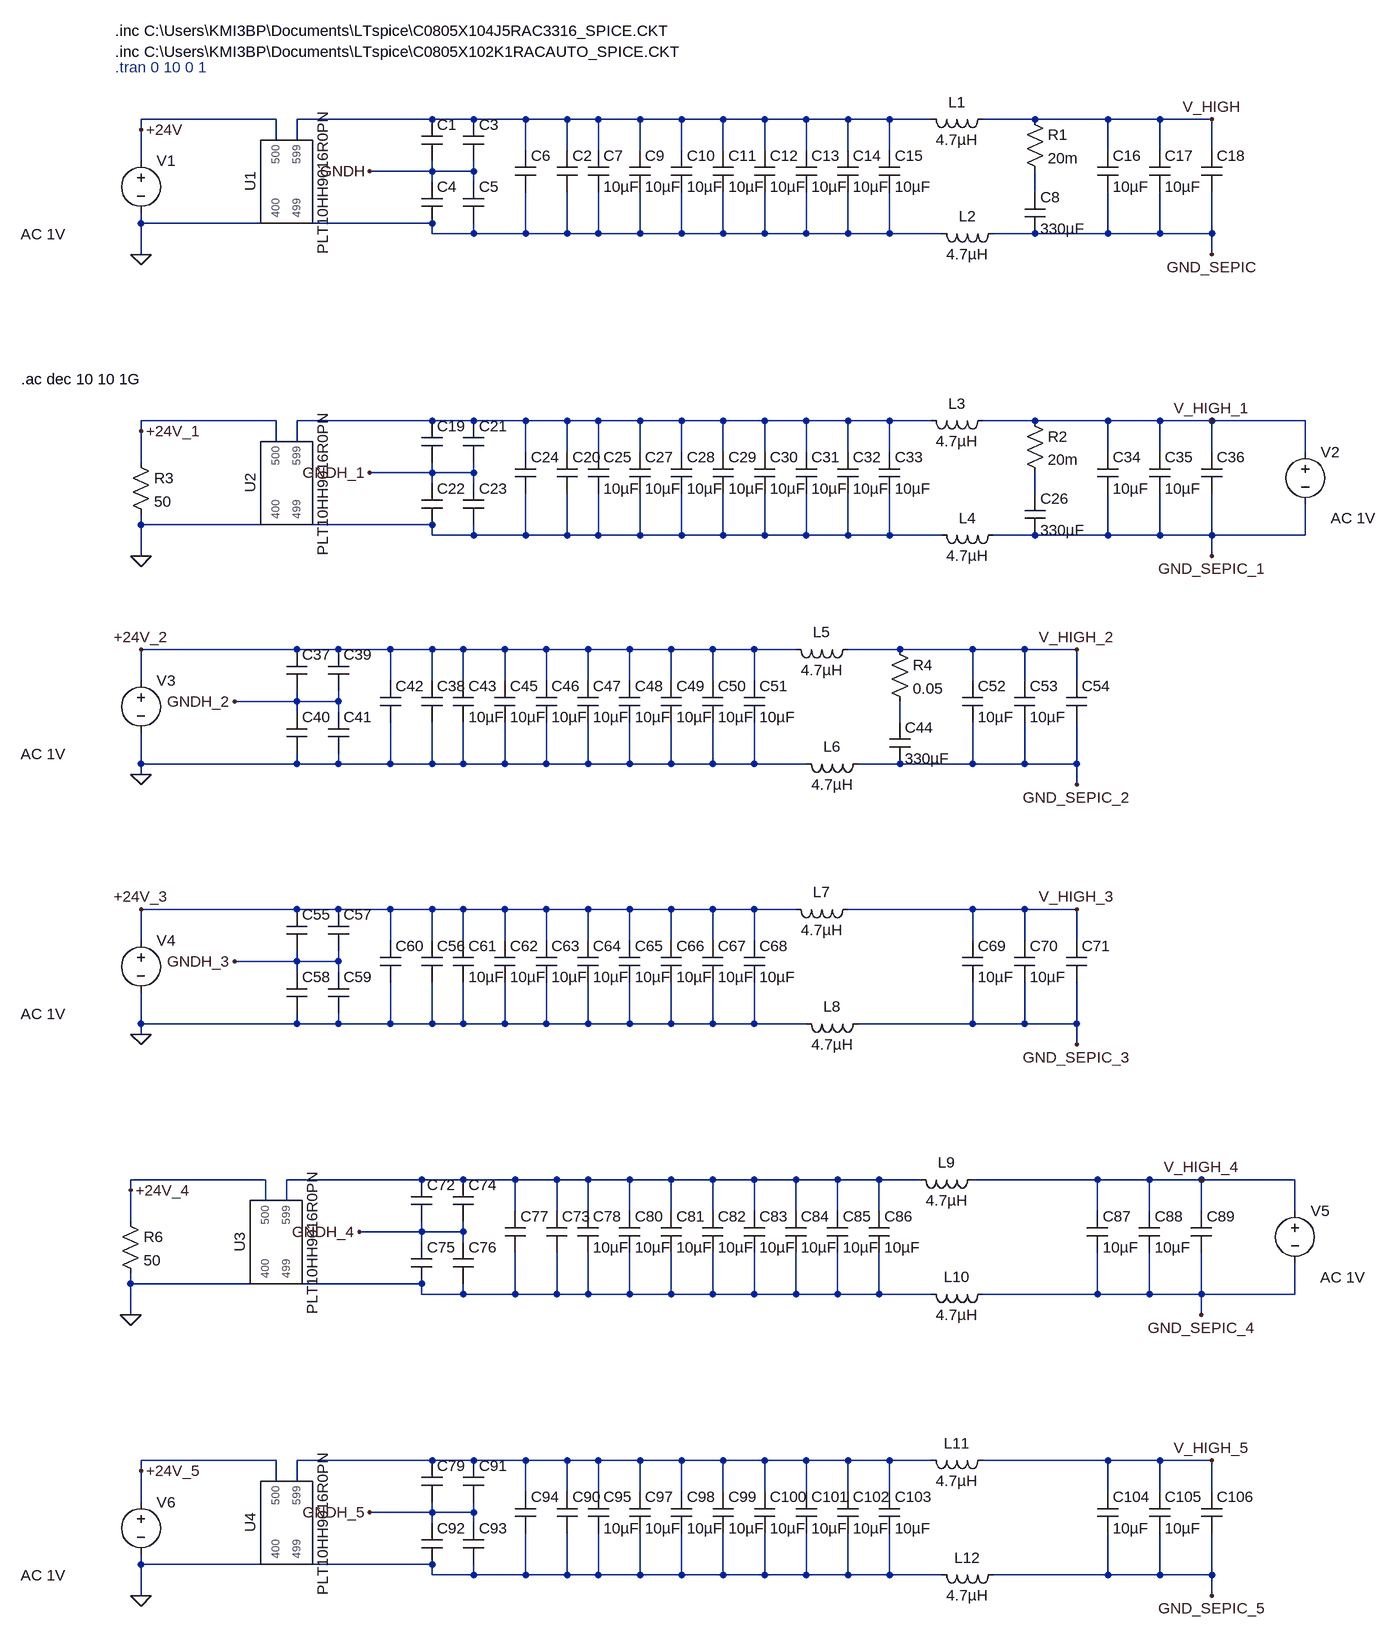
[diagram p0: schematic Draft2.asc]
Draft2.asc, the LTspice schematic file:
Version 4
SHEET 1 1840 3012
WIRE 144 80 -64 80
WIRE 384 80 176 80
WIRE 448 80 384 80
WIRE 528 80 448 80
WIRE 592 80 528 80
WIRE 640 80 592 80
WIRE 704 80 640 80
WIRE 768 80 704 80
WIRE 832 80 768 80
WIRE 896 80 832 80
WIRE 960 80 896 80
WIRE 1024 80 960 80
WIRE 1088 80 1024 80
WIRE 1152 80 1088 80
WIRE 1312 80 1232 80
WIRE 1424 80 1312 80
WIRE 1504 80 1424 80
WIRE 1584 80 1504 80
WIRE -64 96 -64 80
WIRE 144 112 144 80
WIRE 176 112 176 80
WIRE 528 128 528 80
WIRE 592 128 592 80
WIRE 640 128 640 80
WIRE 704 128 704 80
WIRE 768 128 768 80
WIRE 832 128 832 80
WIRE 896 128 896 80
WIRE 960 128 960 80
WIRE 1024 128 1024 80
WIRE 1088 128 1088 80
WIRE 1424 128 1424 80
WIRE 1504 128 1504 80
WIRE 1584 128 1584 80
WIRE -64 144 -64 96
WIRE 384 160 384 144
WIRE 384 160 288 160
WIRE 448 160 448 144
WIRE 448 160 384 160
WIRE 384 176 384 160
WIRE 448 176 448 160
WIRE 1312 192 1312 160
WIRE -64 240 -64 224
WIRE 144 240 -64 240
WIRE 384 240 176 240
WIRE 384 256 384 240
WIRE 448 256 448 240
WIRE 448 256 384 256
WIRE 528 256 528 192
WIRE 528 256 448 256
WIRE 592 256 592 192
WIRE 592 256 528 256
WIRE 640 256 640 192
WIRE 640 256 592 256
WIRE 704 256 704 192
WIRE 704 256 640 256
WIRE 768 256 768 192
WIRE 768 256 704 256
WIRE 832 256 832 192
WIRE 832 256 768 256
WIRE 896 256 896 192
WIRE 896 256 832 256
WIRE 960 256 960 192
WIRE 960 256 896 256
WIRE 1024 256 1024 192
WIRE 1024 256 960 256
WIRE 1088 256 1088 192
WIRE 1088 256 1024 256
WIRE 1168 256 1088 256
WIRE 1312 256 1248 256
WIRE 1424 256 1424 192
WIRE 1424 256 1312 256
WIRE 1504 256 1504 192
WIRE 1504 256 1424 256
WIRE 1584 256 1584 192
WIRE 1584 256 1504 256
WIRE -64 288 -64 240
WIRE 1584 288 1584 256
WIRE 144 544 -64 544
WIRE 384 544 176 544
WIRE 448 544 384 544
WIRE 528 544 448 544
WIRE 592 544 528 544
WIRE 640 544 592 544
WIRE 704 544 640 544
WIRE 768 544 704 544
WIRE 832 544 768 544
WIRE 896 544 832 544
WIRE 960 544 896 544
WIRE 1024 544 960 544
WIRE 1088 544 1024 544
WIRE 1152 544 1088 544
WIRE 1312 544 1232 544
WIRE 1424 544 1312 544
WIRE 1504 544 1424 544
WIRE 1584 544 1504 544
WIRE 1728 544 1584 544
WIRE -64 560 -64 544
WIRE 144 576 144 544
WIRE 176 576 176 544
WIRE 528 592 528 544
WIRE 592 592 592 544
WIRE 640 592 640 544
WIRE 704 592 704 544
WIRE 768 592 768 544
WIRE 832 592 832 544
WIRE 896 592 896 544
WIRE 960 592 960 544
WIRE 1024 592 1024 544
WIRE 1088 592 1088 544
WIRE 1424 592 1424 544
WIRE 1504 592 1504 544
WIRE 1584 592 1584 544
WIRE 1728 592 1728 544
WIRE -64 608 -64 560
WIRE 384 624 384 608
WIRE 384 624 288 624
WIRE 448 624 448 608
WIRE 448 624 384 624
WIRE 384 640 384 624
WIRE 448 640 448 624
WIRE 1312 656 1312 624
WIRE -64 704 -64 688
WIRE 144 704 -64 704
WIRE 384 704 176 704
WIRE 384 720 384 704
WIRE 448 720 448 704
WIRE 448 720 384 720
WIRE 528 720 528 656
WIRE 528 720 448 720
WIRE 592 720 592 656
WIRE 592 720 528 720
WIRE 640 720 640 656
WIRE 640 720 592 720
WIRE 704 720 704 656
WIRE 704 720 640 720
WIRE 768 720 768 656
WIRE 768 720 704 720
WIRE 832 720 832 656
WIRE 832 720 768 720
WIRE 896 720 896 656
WIRE 896 720 832 720
WIRE 960 720 960 656
WIRE 960 720 896 720
WIRE 1024 720 1024 656
WIRE 1024 720 960 720
WIRE 1088 720 1088 656
WIRE 1088 720 1024 720
WIRE 1168 720 1088 720
WIRE 1312 720 1248 720
WIRE 1424 720 1424 656
WIRE 1424 720 1312 720
WIRE 1504 720 1504 656
WIRE 1504 720 1424 720
WIRE 1584 720 1584 656
WIRE 1584 720 1504 720
WIRE 1728 720 1728 672
WIRE 1728 720 1584 720
WIRE -64 752 -64 704
WIRE 1584 752 1584 720
WIRE 176 896 -64 896
WIRE 240 896 176 896
WIRE 320 896 240 896
WIRE 384 896 320 896
WIRE 432 896 384 896
WIRE 496 896 432 896
WIRE 560 896 496 896
WIRE 624 896 560 896
WIRE 688 896 624 896
WIRE 752 896 688 896
WIRE 816 896 752 896
WIRE 880 896 816 896
WIRE 944 896 880 896
WIRE 1104 896 1024 896
WIRE 1216 896 1104 896
WIRE 1296 896 1216 896
WIRE 1376 896 1296 896
WIRE -64 944 -64 896
WIRE 320 944 320 896
WIRE 384 944 384 896
WIRE 432 944 432 896
WIRE 496 944 496 896
WIRE 560 944 560 896
WIRE 624 944 624 896
WIRE 688 944 688 896
WIRE 752 944 752 896
WIRE 816 944 816 896
WIRE 880 944 880 896
WIRE 1216 944 1216 896
WIRE 1296 944 1296 896
WIRE 1376 944 1376 896
WIRE 176 976 176 960
WIRE 176 976 80 976
WIRE 240 976 240 960
WIRE 240 976 176 976
WIRE 176 992 176 976
WIRE 240 992 240 976
WIRE 1104 1008 1104 976
WIRE -64 1072 -64 1024
WIRE 176 1072 176 1056
WIRE 176 1072 -64 1072
WIRE 240 1072 240 1056
WIRE 240 1072 176 1072
WIRE 320 1072 320 1008
WIRE 320 1072 240 1072
WIRE 384 1072 384 1008
WIRE 384 1072 320 1072
WIRE 432 1072 432 1008
WIRE 432 1072 384 1072
WIRE 496 1072 496 1008
WIRE 496 1072 432 1072
WIRE 560 1072 560 1008
WIRE 560 1072 496 1072
WIRE 624 1072 624 1008
WIRE 624 1072 560 1072
WIRE 688 1072 688 1008
WIRE 688 1072 624 1072
WIRE 752 1072 752 1008
WIRE 752 1072 688 1072
WIRE 816 1072 816 1008
WIRE 816 1072 752 1072
WIRE 880 1072 880 1008
WIRE 880 1072 816 1072
WIRE 960 1072 880 1072
WIRE 1104 1072 1040 1072
WIRE 1216 1072 1216 1008
WIRE 1216 1072 1104 1072
WIRE 1296 1072 1296 1008
WIRE 1296 1072 1216 1072
WIRE 1376 1072 1376 1008
WIRE 1376 1072 1296 1072
WIRE -64 1088 -64 1072
WIRE 1376 1104 1376 1072
WIRE 176 1296 -64 1296
WIRE 240 1296 176 1296
WIRE 320 1296 240 1296
WIRE 384 1296 320 1296
WIRE 432 1296 384 1296
WIRE 496 1296 432 1296
WIRE 560 1296 496 1296
WIRE 624 1296 560 1296
WIRE 688 1296 624 1296
WIRE 752 1296 688 1296
WIRE 816 1296 752 1296
WIRE 880 1296 816 1296
WIRE 944 1296 880 1296
WIRE 1216 1296 1024 1296
WIRE 1296 1296 1216 1296
WIRE 1376 1296 1296 1296
WIRE -64 1344 -64 1296
WIRE 320 1344 320 1296
WIRE 384 1344 384 1296
WIRE 432 1344 432 1296
WIRE 496 1344 496 1296
WIRE 560 1344 560 1296
WIRE 624 1344 624 1296
WIRE 688 1344 688 1296
WIRE 752 1344 752 1296
WIRE 816 1344 816 1296
WIRE 880 1344 880 1296
WIRE 1216 1344 1216 1296
WIRE 1296 1344 1296 1296
WIRE 1376 1344 1376 1296
WIRE 176 1376 176 1360
WIRE 176 1376 80 1376
WIRE 240 1376 240 1360
WIRE 240 1376 176 1376
WIRE 176 1392 176 1376
WIRE 240 1392 240 1376
WIRE -64 1472 -64 1424
WIRE 176 1472 176 1456
WIRE 176 1472 -64 1472
WIRE 240 1472 240 1456
WIRE 240 1472 176 1472
WIRE 320 1472 320 1408
WIRE 320 1472 240 1472
WIRE 384 1472 384 1408
WIRE 384 1472 320 1472
WIRE 432 1472 432 1408
WIRE 432 1472 384 1472
WIRE 496 1472 496 1408
WIRE 496 1472 432 1472
WIRE 560 1472 560 1408
WIRE 560 1472 496 1472
WIRE 624 1472 624 1408
WIRE 624 1472 560 1472
WIRE 688 1472 688 1408
WIRE 688 1472 624 1472
WIRE 752 1472 752 1408
WIRE 752 1472 688 1472
WIRE 816 1472 816 1408
WIRE 816 1472 752 1472
WIRE 880 1472 880 1408
WIRE 880 1472 816 1472
WIRE 960 1472 880 1472
WIRE 1216 1472 1216 1408
WIRE 1216 1472 1040 1472
WIRE 1296 1472 1296 1408
WIRE 1296 1472 1216 1472
WIRE 1376 1472 1376 1408
WIRE 1376 1472 1296 1472
WIRE -64 1488 -64 1472
WIRE 1376 1504 1376 1472
WIRE 128 1712 -80 1712
WIRE 368 1712 160 1712
WIRE 432 1712 368 1712
WIRE 512 1712 432 1712
WIRE 576 1712 512 1712
WIRE 624 1712 576 1712
WIRE 688 1712 624 1712
WIRE 752 1712 688 1712
WIRE 816 1712 752 1712
WIRE 880 1712 816 1712
WIRE 944 1712 880 1712
WIRE 1008 1712 944 1712
WIRE 1072 1712 1008 1712
WIRE 1136 1712 1072 1712
WIRE 1408 1712 1216 1712
WIRE 1488 1712 1408 1712
WIRE 1568 1712 1488 1712
WIRE 1712 1712 1568 1712
WIRE -80 1728 -80 1712
WIRE 128 1744 128 1712
WIRE 160 1744 160 1712
WIRE 512 1760 512 1712
WIRE 576 1760 576 1712
WIRE 624 1760 624 1712
WIRE 688 1760 688 1712
WIRE 752 1760 752 1712
WIRE 816 1760 816 1712
WIRE 880 1760 880 1712
WIRE 944 1760 944 1712
WIRE 1008 1760 1008 1712
WIRE 1072 1760 1072 1712
WIRE 1408 1760 1408 1712
WIRE 1488 1760 1488 1712
WIRE 1568 1760 1568 1712
WIRE 1712 1760 1712 1712
WIRE -80 1776 -80 1728
WIRE 368 1792 368 1776
WIRE 368 1792 272 1792
WIRE 432 1792 432 1776
WIRE 432 1792 368 1792
WIRE 368 1808 368 1792
WIRE 432 1808 432 1792
WIRE -80 1872 -80 1856
WIRE 128 1872 -80 1872
WIRE 368 1872 160 1872
WIRE 368 1888 368 1872
WIRE 432 1888 432 1872
WIRE 432 1888 368 1888
WIRE 512 1888 512 1824
WIRE 512 1888 432 1888
WIRE 576 1888 576 1824
WIRE 576 1888 512 1888
WIRE 624 1888 624 1824
WIRE 624 1888 576 1888
WIRE 688 1888 688 1824
WIRE 688 1888 624 1888
WIRE 752 1888 752 1824
WIRE 752 1888 688 1888
WIRE 816 1888 816 1824
WIRE 816 1888 752 1888
WIRE 880 1888 880 1824
WIRE 880 1888 816 1888
WIRE 944 1888 944 1824
WIRE 944 1888 880 1888
WIRE 1008 1888 1008 1824
WIRE 1008 1888 944 1888
WIRE 1072 1888 1072 1824
WIRE 1072 1888 1008 1888
WIRE 1152 1888 1072 1888
WIRE 1408 1888 1408 1824
WIRE 1408 1888 1232 1888
WIRE 1488 1888 1488 1824
WIRE 1488 1888 1408 1888
WIRE 1568 1888 1568 1824
WIRE 1568 1888 1488 1888
WIRE 1712 1888 1712 1840
WIRE 1712 1888 1568 1888
WIRE -80 1920 -80 1872
WIRE 1568 1920 1568 1888
WIRE 144 2144 -64 2144
WIRE 384 2144 176 2144
WIRE 448 2144 384 2144
WIRE 528 2144 448 2144
WIRE 592 2144 528 2144
WIRE 640 2144 592 2144
WIRE 704 2144 640 2144
WIRE 768 2144 704 2144
WIRE 832 2144 768 2144
WIRE 896 2144 832 2144
WIRE 960 2144 896 2144
WIRE 1024 2144 960 2144
WIRE 1088 2144 1024 2144
WIRE 1152 2144 1088 2144
WIRE 1424 2144 1232 2144
WIRE 1504 2144 1424 2144
WIRE 1584 2144 1504 2144
WIRE -64 2160 -64 2144
WIRE 144 2176 144 2144
WIRE 176 2176 176 2144
WIRE 528 2192 528 2144
WIRE 592 2192 592 2144
WIRE 640 2192 640 2144
WIRE 704 2192 704 2144
WIRE 768 2192 768 2144
WIRE 832 2192 832 2144
WIRE 896 2192 896 2144
WIRE 960 2192 960 2144
WIRE 1024 2192 1024 2144
WIRE 1088 2192 1088 2144
WIRE 1424 2192 1424 2144
WIRE 1504 2192 1504 2144
WIRE 1584 2192 1584 2144
WIRE -64 2208 -64 2160
WIRE 384 2224 384 2208
WIRE 384 2224 288 2224
WIRE 448 2224 448 2208
WIRE 448 2224 384 2224
WIRE 384 2240 384 2224
WIRE 448 2240 448 2224
WIRE -64 2304 -64 2288
WIRE 144 2304 -64 2304
WIRE 384 2304 176 2304
WIRE 384 2320 384 2304
WIRE 448 2320 448 2304
WIRE 448 2320 384 2320
WIRE 528 2320 528 2256
WIRE 528 2320 448 2320
WIRE 592 2320 592 2256
WIRE 592 2320 528 2320
WIRE 640 2320 640 2256
WIRE 640 2320 592 2320
WIRE 704 2320 704 2256
WIRE 704 2320 640 2320
WIRE 768 2320 768 2256
WIRE 768 2320 704 2320
WIRE 832 2320 832 2256
WIRE 832 2320 768 2320
WIRE 896 2320 896 2256
WIRE 896 2320 832 2320
WIRE 960 2320 960 2256
WIRE 960 2320 896 2320
WIRE 1024 2320 1024 2256
WIRE 1024 2320 960 2320
WIRE 1088 2320 1088 2256
WIRE 1088 2320 1024 2320
WIRE 1168 2320 1088 2320
WIRE 1424 2320 1424 2256
WIRE 1424 2320 1248 2320
WIRE 1504 2320 1504 2256
WIRE 1504 2320 1424 2320
WIRE 1584 2320 1584 2256
WIRE 1584 2320 1504 2320
WIRE -64 2352 -64 2304
WIRE 1584 2352 1584 2320
FLAG -64 288 0
FLAG -64 96 +24V
FLAG 288 160 GNDH
FLAG 1584 288 GND_SEPIC
FLAG 1584 80 V_HIGH
FLAG -64 752 0
FLAG -64 560 +24V_1
FLAG 288 624 GNDH_1
FLAG 1584 752 GND_SEPIC_1
FLAG 1584 544 V_HIGH_1
FLAG 80 976 GNDH_2
FLAG -64 1088 0
FLAG 1376 1104 GND_SEPIC_2
FLAG 1376 896 V_HIGH_2
FLAG -64 896 +24V_2
FLAG 80 1376 GNDH_3
FLAG -64 1488 0
FLAG 1376 1504 GND_SEPIC_3
FLAG 1376 1296 V_HIGH_3
FLAG -64 1296 +24V_3
FLAG -80 1920 0
FLAG -80 1728 +24V_4
FLAG 272 1792 GNDH_4
FLAG 1568 1920 GND_SEPIC_4
FLAG 1568 1712 V_HIGH_4
FLAG -64 2352 0
FLAG -64 2160 +24V_5
FLAG 288 2224 GNDH_5
FLAG 1584 2352 GND_SEPIC_5
FLAG 1584 2144 V_HIGH_5
SYMBOL PLT10HH9016R0PN 160 176 R270
SYMATTR InstName U1
SYMBOL voltage -64 128 R0
WINDOW 3 -185 101 Left 2
WINDOW 123 -185 129 Left 2
WINDOW 39 0 0 Left 0
SYMATTR InstName V1
SYMATTR Value ""
SYMATTR Value2 AC 1V
SYMBOL cap 368 80 R0
WINDOW 3 24 56 Invisible 2
SYMATTR InstName C1
SYMATTR Value C0805X102K1RACAUTO
SYMATTR Prefix X
SYMBOL cap 576 128 R0
WINDOW 3 24 56 Invisible 2
SYMATTR InstName C2
SYMATTR Value C0805X104J5RAC3316
SYMATTR Prefix X
SYMBOL cap 432 80 R0
WINDOW 3 24 56 Invisible 2
SYMATTR InstName C3
SYMATTR Value C0805X102K1RACAUTO
SYMATTR Prefix X
SYMBOL cap 368 176 R0
WINDOW 3 24 56 Invisible 2
SYMATTR InstName C4
SYMATTR Value C0805X102K1RACAUTO
SYMATTR Prefix X
SYMBOL cap 432 176 R0
WINDOW 3 24 56 Invisible 2
SYMATTR InstName C5
SYMATTR Value C0805X102K1RACAUTO
SYMATTR Prefix X
SYMBOL cap 512 128 R0
WINDOW 3 24 56 Invisible 2
SYMATTR InstName C6
SYMATTR Value C0805X102K1RACAUTO
SYMATTR Prefix X
SYMBOL cap 624 128 R0
SYMATTR InstName C7
SYMATTR Value 10µF
SYMATTR SpiceLine V=50 Rser=2.2m Lser=0.6n Rpar=0.05G
SYMBOL ind 1248 64 R90
WINDOW 0 5 56 VBottom 2
WINDOW 3 32 56 VTop 2
SYMATTR InstName L1
SYMATTR Value 4.7µH
SYMATTR SpiceLine Rser=0.023 Rpar=6.2 Cpar=2.12pF
SYMBOL res 1296 64 R0
SYMATTR InstName R1
SYMATTR Value 20m
SYMATTR SpiceLine tol=1 pwr=125m
SYMBOL cap 1296 192 R0
SYMATTR InstName C8
SYMATTR Value 330µF
SYMATTR SpiceLine V=50 Irms=600m Rser=230m
SYMBOL cap 688 128 R0
SYMATTR InstName C9
SYMATTR Value 10µF
SYMATTR SpiceLine V=50 Rser=2.2m Lser=0.6n Rpar=0.05G
SYMBOL cap 752 128 R0
SYMATTR InstName C10
SYMATTR Value 10µF
SYMATTR SpiceLine V=50 Rser=2.2m Lser=0.6n Rpar=0.05G
SYMBOL cap 816 128 R0
SYMATTR InstName C11
SYMATTR Value 10µF
SYMATTR SpiceLine V=50 Rser=2.2m Lser=0.6n Rpar=0.05G
SYMBOL cap 880 128 R0
SYMATTR InstName C12
SYMATTR Value 10µF
SYMATTR SpiceLine V=50 Rser=2.2m Lser=0.6n Rpar=0.05G
SYMBOL cap 944 128 R0
SYMATTR InstName C13
SYMATTR Value 10µF
SYMATTR SpiceLine V=50 Rser=2.2m Lser=0.6n Rpar=0.05G
SYMBOL cap 1008 128 R0
SYMATTR InstName C14
SYMATTR Value 10µF
SYMATTR SpiceLine V=50 Rser=2.2m Lser=0.6n Rpar=0.05G
SYMBOL cap 1072 128 R0
SYMATTR InstName C15
SYMATTR Value 10µF
SYMATTR SpiceLine V=50 Rser=2.2m Lser=0.6n Rpar=0.05G
SYMBOL ind 1264 240 R90
WINDOW 0 5 56 VBottom 2
WINDOW 3 32 56 VTop 2
SYMATTR InstName L2
SYMATTR Value 4.7µH
SYMATTR SpiceLine Rser=0.023 Rpar=6.2 Cpar=2.12pF
SYMBOL cap 1408 128 R0
SYMATTR InstName C16
SYMATTR Value 10µF
SYMATTR SpiceLine V=50 Rser=2.2m Lser=0.6n Rpar=0.05G
SYMBOL cap 1488 128 R0
SYMATTR InstName C17
SYMATTR Value 10µF
SYMATTR SpiceLine V=50 Rser=2.2m Lser=0.6n Rpar=0.05G
SYMBOL cap 1568 128 R0
WINDOW 3 24 56 Invisible 2
SYMATTR InstName C18
SYMATTR Value C0805X104J5RAC3316
SYMATTR Prefix X
SYMBOL PLT10HH9016R0PN 160 640 R270
SYMATTR InstName U2
SYMBOL voltage 1728 576 R0
WINDOW 3 -185 101 Left 2
WINDOW 123 39 118 Left 2
WINDOW 39 0 0 Left 0
SYMATTR InstName V2
SYMATTR Value ""
SYMATTR Value2 AC 1V
SYMBOL cap 368 544 R0
WINDOW 3 24 56 Invisible 2
SYMATTR InstName C19
SYMATTR Value C0805X102K1RACAUTO
SYMATTR Prefix X
SYMBOL cap 576 592 R0
WINDOW 3 24 56 Invisible 2
SYMATTR InstName C20
SYMATTR Value C0805X104J5RAC3316
SYMATTR Prefix X
SYMBOL cap 432 544 R0
WINDOW 3 24 56 Invisible 2
SYMATTR InstName C21
SYMATTR Value C0805X102K1RACAUTO
SYMATTR Prefix X
SYMBOL cap 368 640 R0
WINDOW 3 24 56 Invisible 2
SYMATTR InstName C22
SYMATTR Value C0805X102K1RACAUTO
SYMATTR Prefix X
SYMBOL cap 432 640 R0
WINDOW 3 24 56 Invisible 2
SYMATTR InstName C23
SYMATTR Value C0805X102K1RACAUTO
SYMATTR Prefix X
SYMBOL cap 512 592 R0
WINDOW 3 24 56 Invisible 2
SYMATTR InstName C24
SYMATTR Value C0805X102K1RACAUTO
SYMATTR Prefix X
SYMBOL cap 624 592 R0
SYMATTR InstName C25
SYMATTR Value 10µF
SYMATTR SpiceLine V=50 Rser=2.2m Lser=0.6n Rpar=0.05G
SYMBOL ind 1248 528 R90
WINDOW 0 5 56 VBottom 2
WINDOW 3 32 56 VTop 2
SYMATTR InstName L3
SYMATTR Value 4.7µH
SYMATTR SpiceLine Rser=0.023 Rpar=6.2 Cpar=2.12pF
SYMBOL res 1296 528 R0
SYMATTR InstName R2
SYMATTR Value 20m
SYMATTR SpiceLine tol=1 pwr=125m
SYMBOL cap 1296 656 R0
SYMATTR InstName C26
SYMATTR Value 330µF
SYMATTR SpiceLine V=50 Irms=600m Rser=230m
SYMBOL cap 688 592 R0
SYMATTR InstName C27
SYMATTR Value 10µF
SYMATTR SpiceLine V=50 Rser=2.2m Lser=0.6n Rpar=0.05G
SYMBOL cap 752 592 R0
SYMATTR InstName C28
SYMATTR Value 10µF
SYMATTR SpiceLine V=50 Rser=2.2m Lser=0.6n Rpar=0.05G
SYMBOL cap 816 592 R0
SYMATTR InstName C29
SYMATTR Value 10µF
SYMATTR SpiceLine V=50 Rser=2.2m Lser=0.6n Rpar=0.05G
SYMBOL cap 880 592 R0
SYMATTR InstName C30
SYMATTR Value 10µF
SYMATTR SpiceLine V=50 Rser=2.2m Lser=0.6n Rpar=0.05G
SYMBOL cap 944 592 R0
SYMATTR InstName C31
SYMATTR Value 10µF
SYMATTR SpiceLine V=50 Rser=2.2m Lser=0.6n Rpar=0.05G
SYMBOL cap 1008 592 R0
SYMATTR InstName C32
SYMATTR Value 10µF
SYMATTR SpiceLine V=50 Rser=2.2m Lser=0.6n Rpar=0.05G
SYMBOL cap 1072 592 R0
SYMATTR InstName C33
SYMATTR Value 10µF
SYMATTR SpiceLine V=50 Rser=2.2m Lser=0.6n Rpar=0.05G
SYMBOL ind 1264 704 R90
WINDOW 0 5 56 VBottom 2
WINDOW 3 32 56 VTop 2
SYMATTR InstName L4
SYMATTR Value 4.7µH
SYMATTR SpiceLine Rser=0.023 Rpar=6.2 Cpar=2.12pF
SYMBOL cap 1408 592 R0
SYMATTR InstName C34
SYMATTR Value 10µF
SYMATTR SpiceLine V=50 Rser=2.2m Lser=0.6n Rpar=0.05G
SYMBOL cap 1488 592 R0
SYMATTR InstName C35
SYMATTR Value 10µF
SYMATTR SpiceLine V=50 Rser=2.2m Lser=0.6n Rpar=0.05G
SYMBOL cap 1568 592 R0
WINDOW 3 24 56 Invisible 2
SYMATTR InstName C36
SYMATTR Value C0805X104J5RAC3316
SYMATTR Prefix X
SYMBOL res -80 592 R0
SYMATTR InstName R3
SYMATTR Value 50
SYMBOL voltage -64 928 R0
WINDOW 3 -185 101 Left 2
WINDOW 123 -185 129 Left 2
WINDOW 39 0 0 Left 0
SYMATTR InstName V3
SYMATTR Value ""
SYMATTR Value2 AC 1V
SYMBOL cap 160 896 R0
WINDOW 3 24 56 Invisible 2
SYMATTR InstName C37
SYMATTR Value C0805X102K1RACAUTO
SYMATTR Prefix X
SYMBOL cap 368 944 R0
WINDOW 3 24 56 Invisible 2
SYMATTR InstName C38
SYMATTR Value C0805X104J5RAC3316
SYMATTR Prefix X
SYMBOL cap 224 896 R0
WINDOW 3 24 56 Invisible 2
SYMATTR InstName C39
SYMATTR Value C0805X102K1RACAUTO
SYMATTR Prefix X
SYMBOL cap 160 992 R0
WINDOW 3 24 56 Invisible 2
SYMATTR InstName C40
SYMATTR Value C0805X102K1RACAUTO
SYMATTR Prefix X
SYMBOL cap 224 992 R0
WINDOW 3 24 56 Invisible 2
SYMATTR InstName C41
SYMATTR Value C0805X102K1RACAUTO
SYMATTR Prefix X
SYMBOL cap 304 944 R0
WINDOW 3 24 56 Invisible 2
SYMATTR InstName C42
SYMATTR Value C0805X102K1RACAUTO
SYMATTR Prefix X
SYMBOL cap 416 944 R0
SYMATTR InstName C43
SYMATTR Value 10µF
SYMATTR SpiceLine V=50 Rser=2.2m Lser=0.6n Rpar=0.05G
SYMBOL ind 1040 880 R90
WINDOW 0 5 56 VBottom 2
WINDOW 3 32 56 VTop 2
SYMATTR InstName L5
SYMATTR Value 4.7µH
SYMATTR SpiceLine Rser=0.023 Rpar=6.2 Cpar=2.12pF
SYMBOL res 1088 880 R0
SYMATTR InstName R4
SYMATTR Value 0.05
SYMATTR SpiceLine tol=1 pwr=125m
SYMBOL cap 1088 1008 R0
SYMATTR InstName C44
SYMATTR Value 330µF
SYMATTR SpiceLine V=50 Irms=600m Rser=230m
SYMBOL cap 480 944 R0
SYMATTR InstName C45
SYMATTR Value 10µF
SYMATTR SpiceLine V=50 Rser=2.2m Lser=0.6n Rpar=0.05G
SYMBOL cap 544 944 R0
SYMATTR InstName C46
SYMATTR Value 10µF
SYMATTR SpiceLine V=50 Rser=2.2m Lser=0.6n Rpar=0.05G
SYMBOL cap 608 944 R0
SYMATTR InstName C47
SYMATTR Value 10µF
SYMATTR SpiceLine V=50 Rser=2.2m Lser=0.6n Rpar=0.05G
SYMBOL cap 672 944 R0
SYMATTR InstName C48
SYMATTR Value 10µF
SYMATTR SpiceLine V=50 Rser=2.2m Lser=0.6n Rpar=0.05G
SYMBOL cap 736 944 R0
SYMATTR InstName C49
SYMATTR Value 10µF
SYMATTR SpiceLine V=50 Rser=2.2m Lser=0.6n Rpar=0.05G
SYMBOL cap 800 944 R0
SYMATTR InstName C50
SYMATTR Value 10µF
SYMATTR SpiceLine V=50 Rser=2.2m Lser=0.6n Rpar=0.05G
SYMBOL cap 864 944 R0
SYMATTR InstName C51
SYMATTR Value 10µF
SYMATTR SpiceLine V=50 Rser=2.2m Lser=0.6n Rpar=0.05G
SYMBOL ind 1056 1056 R90
WINDOW 0 5 56 VBottom 2
WINDOW 3 32 56 VTop 2
SYMATTR InstName L6
SYMATTR Value 4.7µH
SYMATTR SpiceLine Rser=0.023 Rpar=6.2 Cpar=2.12pF
SYMBOL cap 1200 944 R0
SYMATTR InstName C52
SYMATTR Value 10µF
SYMATTR SpiceLine V=50 Rser=2.2m Lser=0.6n Rpar=0.05G
SYMBOL cap 1280 944 R0
SYMATTR InstName C53
SYMATTR Value 10µF
SYMATTR SpiceLine V=50 Rser=2.2m Lser=0.6n Rpar=0.05G
SYMBOL cap 1360 944 R0
WINDOW 3 24 56 Invisible 2
SYMATTR InstName C54
SYMATTR Value C0805X104J5RAC3316
SYMATTR Prefix X
SYMBOL voltage -64 1328 R0
WINDOW 3 -185 101 Left 2
WINDOW 123 -185 129 Left 2
WINDOW 39 0 0 Left 0
SYMATTR InstName V4
SYMATTR Value ""
SYMATTR Value2 AC 1V
SYMBOL cap 160 1296 R0
WINDOW 3 24 56 Invisible 2
SYMATTR InstName C55
SYMATTR Value C0805X102K1RACAUTO
SYMATTR Prefix X
SYMBOL cap 368 1344 R0
WINDOW 3 24 56 Invisible 2
SYMATTR InstName C56
SYMATTR Value C0805X104J5RAC3316
SYMATTR Prefix X
SYMBOL cap 224 1296 R0
WINDOW 3 24 56 Invisible 2
SYMATTR InstName C57
SYMATTR Value C0805X102K1RACAUTO
SYMATTR Prefix X
SYMBOL cap 160 1392 R0
WINDOW 3 24 56 Invisible 2
SYMATTR InstName C58
SYMATTR Value C0805X102K1RACAUTO
SYMATTR Prefix X
SYMBOL cap 224 1392 R0
WINDOW 3 24 56 Invisible 2
SYMATTR InstName C59
SYMATTR Value C0805X102K1RACAUTO
SYMATTR Prefix X
SYMBOL cap 304 1344 R0
WINDOW 3 24 56 Invisible 2
SYMATTR InstName C60
SYMATTR Value C0805X102K1RACAUTO
SYMATTR Prefix X
SYMBOL cap 416 1344 R0
SYMATTR InstName C61
SYMATTR Value 10µF
SYMATTR SpiceLine V=50 Rser=2.2m Lser=0.6n Rpar=0.05G
SYMBOL ind 1040 1280 R90
WINDOW 0 5 56 VBottom 2
WINDOW 3 32 56 VTop 2
SYMATTR InstName L7
SYMATTR Value 4.7µH
SYMATTR SpiceLine Rser=0.023 Rpar=6.2 Cpar=2.12pF
SYMBOL cap 480 1344 R0
SYMATTR InstName C62
SYMATTR Value 10µF
SYMATTR SpiceLine V=50 Rser=2.2m Lser=0.6n Rpar=0.05G
SYMBOL cap 544 1344 R0
SYMATTR InstName C63
SYMATTR Value 10µF
SYMATTR SpiceLine V=50 Rser=2.2m Lser=0.6n Rpar=0.05G
SYMBOL cap 608 1344 R0
SYMATTR InstName C64
SYMATTR Value 10µF
SYMATTR SpiceLine V=50 Rser=2.2m Lser=0.6n Rpar=0.05G
SYMBOL cap 672 1344 R0
SYMATTR InstName C65
SYMATTR Value 10µF
SYMATTR SpiceLine V=50 Rser=2.2m Lser=0.6n Rpar=0.05G
SYMBOL cap 736 1344 R0
SYMATTR InstName C66
SYMATTR Value 10µF
SYMATTR SpiceLine V=50 Rser=2.2m Lser=0.6n Rpar=0.05G
SYMBOL cap 800 1344 R0
SYMATTR InstName C67
SYMATTR Value 10µF
SYMATTR SpiceLine V=50 Rser=2.2m Lser=0.6n Rpar=0.05G
SYMBOL cap 864 1344 R0
SYMATTR InstName C68
SYMATTR Value 10µF
SYMATTR SpiceLine V=50 Rser=2.2m Lser=0.6n Rpar=0.05G
SYMBOL ind 1056 1456 R90
WINDOW 0 5 56 VBottom 2
WINDOW 3 32 56 VTop 2
SYMATTR InstName L8
SYMATTR Value 4.7µH
SYMATTR SpiceLine Rser=0.023 Rpar=6.2 Cpar=2.12pF
SYMBOL cap 1200 1344 R0
SYMATTR InstName C69
SYMATTR Value 10µF
SYMATTR SpiceLine V=50 Rser=2.2m Lser=0.6n Rpar=0.05G
SYMBOL cap 1280 1344 R0
SYMATTR InstName C70
SYMATTR Value 10µF
SYMATTR SpiceLine V=50 Rser=2.2m Lser=0.6n Rpar=0.05G
SYMBOL cap 1360 1344 R0
WINDOW 3 24 56 Invisible 2
SYMATTR InstName C71
SYMATTR Value C0805X104J5RAC3316
SYMATTR Prefix X
SYMBOL PLT10HH9016R0PN 144 1808 R270
SYMATTR InstName U3
SYMBOL voltage 1712 1744 R0
WINDOW 3 -185 101 Left 2
WINDOW 123 39 118 Left 2
WINDOW 39 0 0 Left 0
SYMATTR InstName V5
SYMATTR Value ""
SYMATTR Value2 AC 1V
SYMBOL cap 352 1712 R0
WINDOW 3 24 56 Invisible 2
SYMATTR InstName C72
SYMATTR Value C0805X102K1RACAUTO
SYMATTR Prefix X
SYMBOL cap 560 1760 R0
WINDOW 3 24 56 Invisible 2
SYMATTR InstName C73
SYMATTR Value C0805X104J5RAC3316
SYMATTR Prefix X
SYMBOL cap 416 1712 R0
WINDOW 3 24 56 Invisible 2
SYMATTR InstName C74
SYMATTR Value C0805X102K1RACAUTO
SYMATTR Prefix X
SYMBOL cap 352 1808 R0
WINDOW 3 24 56 Invisible 2
SYMATTR InstName C75
SYMATTR Value C0805X102K1RACAUTO
SYMATTR Prefix X
SYMBOL cap 416 1808 R0
WINDOW 3 24 56 Invisible 2
SYMATTR InstName C76
SYMATTR Value C0805X102K1RACAUTO
SYMATTR Prefix X
SYMBOL cap 496 1760 R0
WINDOW 3 24 56 Invisible 2
SYMATTR InstName C77
SYMATTR Value C0805X102K1RACAUTO
SYMATTR Prefix X
SYMBOL cap 608 1760 R0
SYMATTR InstName C78
SYMATTR Value 10µF
SYMATTR SpiceLine V=50 Rser=2.2m Lser=0.6n Rpar=0.05G
SYMBOL ind 1232 1696 R90
WINDOW 0 5 56 VBottom 2
WINDOW 3 32 56 VTop 2
SYMATTR InstName L9
SYMATTR Value 4.7µH
SYMATTR SpiceLine Rser=0.023 Rpar=6.2 Cpar=2.12pF
SYMBOL cap 672 1760 R0
SYMATTR InstName C80
SYMATTR Value 10µF
SYMATTR SpiceLine V=50 Rser=2.2m Lser=0.6n Rpar=0.05G
SYMBOL cap 736 1760 R0
SYMATTR InstName C81
SYMATTR Value 10µF
SYMATTR SpiceLine V=50 Rser=2.2m Lser=0.6n Rpar=0.05G
SYMBOL cap 800 1760 R0
SYMATTR InstName C82
SYMATTR Value 10µF
SYMATTR SpiceLine V=50 Rser=2.2m Lser=0.6n Rpar=0.05G
SYMBOL cap 864 1760 R0
SYMATTR InstName C83
SYMATTR Value 10µF
SYMATTR SpiceLine V=50 Rser=2.2m Lser=0.6n Rpar=0.05G
SYMBOL cap 928 1760 R0
SYMATTR InstName C84
SYMATTR Value 10µF
SYMATTR SpiceLine V=50 Rser=2.2m Lser=0.6n Rpar=0.05G
SYMBOL cap 992 1760 R0
SYMATTR InstName C85
SYMATTR Value 10µF
SYMATTR SpiceLine V=50 Rser=2.2m Lser=0.6n Rpar=0.05G
SYMBOL cap 1056 1760 R0
SYMATTR InstName C86
SYMATTR Value 10µF
SYMATTR SpiceLine V=50 Rser=2.2m Lser=0.6n Rpar=0.05G
SYMBOL ind 1248 1872 R90
WINDOW 0 5 56 VBottom 2
WINDOW 3 32 56 VTop 2
SYMATTR InstName L10
SYMATTR Value 4.7µH
SYMATTR SpiceLine Rser=0.023 Rpar=6.2 Cpar=2.12pF
SYMBOL cap 1392 1760 R0
SYMATTR InstName C87
SYMATTR Value 10µF
SYMATTR SpiceLine V=50 Rser=2.2m Lser=0.6n Rpar=0.05G
SYMBOL cap 1472 1760 R0
SYMATTR InstName C88
SYMATTR Value 10µF
SYMATTR SpiceLine V=50 Rser=2.2m Lser=0.6n Rpar=0.05G
SYMBOL cap 1552 1760 R0
WINDOW 3 24 56 Invisible 2
SYMATTR InstName C89
SYMATTR Value C0805X104J5RAC3316
SYMATTR Prefix X
SYMBOL res -96 1760 R0
SYMATTR InstName R6
SYMATTR Value 50
SYMBOL PLT10HH9016R0PN 160 2240 R270
SYMATTR InstName U4
SYMBOL voltage -64 2192 R0
WINDOW 3 -185 101 Left 2
WINDOW 123 -185 129 Left 2
WINDOW 39 0 0 Left 0
SYMATTR InstName V6
SYMATTR Value ""
SYMATTR Value2 AC 1V
SYMBOL cap 368 2144 R0
WINDOW 3 24 56 Invisible 2
SYMATTR InstName C79
SYMATTR Value C0805X102K1RACAUTO
SYMATTR Prefix X
SYMBOL cap 576 2192 R0
WINDOW 3 24 56 Invisible 2
SYMATTR InstName C90
SYMATTR Value C0805X104J5RAC3316
SYMATTR Prefix X
SYMBOL cap 432 2144 R0
WINDOW 3 24 56 Invisible 2
SYMATTR InstName C91
SYMATTR Value C0805X102K1RACAUTO
SYMATTR Prefix X
SYMBOL cap 368 2240 R0
WINDOW 3 24 56 Invisible 2
SYMATTR InstName C92
SYMATTR Value C0805X102K1RACAUTO
SYMATTR Prefix X
SYMBOL cap 432 2240 R0
WINDOW 3 24 56 Invisible 2
SYMATTR InstName C93
SYMATTR Value C0805X102K1RACAUTO
SYMATTR Prefix X
SYMBOL cap 512 2192 R0
WINDOW 3 24 56 Invisible 2
SYMATTR InstName C94
SYMATTR Value C0805X102K1RACAUTO
SYMATTR Prefix X
SYMBOL cap 624 2192 R0
SYMATTR InstName C95
SYMATTR Value 10µF
SYMATTR SpiceLine V=50 Rser=2.2m Lser=0.6n Rpar=0.05G
SYMBOL ind 1248 2128 R90
WINDOW 0 5 56 VBottom 2
WINDOW 3 32 56 VTop 2
SYMATTR InstName L11
SYMATTR Value 4.7µH
SYMATTR SpiceLine Rser=0.023 Rpar=6.2 Cpar=2.12pF
SYMBOL cap 688 2192 R0
SYMATTR InstName C97
SYMATTR Value 10µF
SYMATTR SpiceLine V=50 Rser=2.2m Lser=0.6n Rpar=0.05G
SYMBOL cap 752 2192 R0
SYMATTR InstName C98
SYMATTR Value 10µF
SYMATTR SpiceLine V=50 Rser=2.2m Lser=0.6n Rpar=0.05G
SYMBOL cap 816 2192 R0
SYMATTR InstName C99
SYMATTR Value 10µF
SYMATTR SpiceLine V=50 Rser=2.2m Lser=0.6n Rpar=0.05G
SYMBOL cap 880 2192 R0
SYMATTR InstName C100
SYMATTR Value 10µF
SYMATTR SpiceLine V=50 Rser=2.2m Lser=0.6n Rpar=0.05G
SYMBOL cap 944 2192 R0
SYMATTR InstName C101
SYMATTR Value 10µF
SYMATTR SpiceLine V=50 Rser=2.2m Lser=0.6n Rpar=0.05G
SYMBOL cap 1008 2192 R0
SYMATTR InstName C102
SYMATTR Value 10µF
SYMATTR SpiceLine V=50 Rser=2.2m Lser=0.6n Rpar=0.05G
SYMBOL cap 1072 2192 R0
SYMATTR InstName C103
SYMATTR Value 10µF
SYMATTR SpiceLine V=50 Rser=2.2m Lser=0.6n Rpar=0.05G
SYMBOL ind 1264 2304 R90
WINDOW 0 5 56 VBottom 2
WINDOW 3 32 56 VTop 2
SYMATTR InstName L12
SYMATTR Value 4.7µH
SYMATTR SpiceLine Rser=0.023 Rpar=6.2 Cpar=2.12pF
SYMBOL cap 1408 2192 R0
SYMATTR InstName C104
SYMATTR Value 10µF
SYMATTR SpiceLine V=50 Rser=2.2m Lser=0.6n Rpar=0.05G
SYMBOL cap 1488 2192 R0
SYMATTR InstName C105
SYMATTR Value 10µF
SYMATTR SpiceLine V=50 Rser=2.2m Lser=0.6n Rpar=0.05G
SYMBOL cap 1568 2192 R0
WINDOW 3 24 56 Invisible 2
SYMATTR InstName C106
SYMATTR Value C0805X104J5RAC3316
SYMATTR Prefix X
TEXT -248 480 Left 2 !.ac dec 10 10 1G
TEXT -104 -56 Left 2 !.inc C:\\Users\\KMI3BP\\Documents\\LTspice\\C0805X104J5RAC3316_SPICE.CKT
TEXT -104 -24 Left 2 !.inc C:\\Users\\KMI3BP\\Documents\\LTspice\\C0805X102K1RACAUTO_SPICE.CKT
TEXT -104 0 Left 2 ;.tran 0 10 0 1

The netlist it stands for:
* Draft2.asc
XU1 0 N003 +24V N001 PLT10HH9016R0PN  ; pins 400 499 500 599
V1 +24V 0 AC 1V
XC1 N001 GNDH C0805X102K1RACAUTO  ; pins A B
XC2 N001 N003 C0805X104J5RAC3316  ; pins A B
XC3 N001 GNDH C0805X102K1RACAUTO  ; pins A B
XC4 GNDH N003 C0805X102K1RACAUTO  ; pins A B
XC5 GNDH N003 C0805X102K1RACAUTO  ; pins A B
XC6 N001 N003 C0805X102K1RACAUTO  ; pins A B
C7 N001 N003 10µF V=50 Rser=2.2m Lser=0.6n Rpar=0.05G
L1 V_HIGH N001 4.7µH Rser=0.023 Rpar=6.2 Cpar=2.12pF
R1 V_HIGH N002 20m tol=1 pwr=125m
C8 N002 GND_SEPIC 330µF V=50 Irms=600m Rser=230m
C9 N001 N003 10µF V=50 Rser=2.2m Lser=0.6n Rpar=0.05G
C10 N001 N003 10µF V=50 Rser=2.2m Lser=0.6n Rpar=0.05G
C11 N001 N003 10µF V=50 Rser=2.2m Lser=0.6n Rpar=0.05G
C12 N001 N003 10µF V=50 Rser=2.2m Lser=0.6n Rpar=0.05G
C13 N001 N003 10µF V=50 Rser=2.2m Lser=0.6n Rpar=0.05G
C14 N001 N003 10µF V=50 Rser=2.2m Lser=0.6n Rpar=0.05G
C15 N001 N003 10µF V=50 Rser=2.2m Lser=0.6n Rpar=0.05G
L2 GND_SEPIC N003 4.7µH Rser=0.023 Rpar=6.2 Cpar=2.12pF
C16 V_HIGH GND_SEPIC 10µF V=50 Rser=2.2m Lser=0.6n Rpar=0.05G
C17 V_HIGH GND_SEPIC 10µF V=50 Rser=2.2m Lser=0.6n Rpar=0.05G
XC18 V_HIGH GND_SEPIC C0805X104J5RAC3316  ; pins A B
XU2 0 N006 +24V_1 N004 PLT10HH9016R0PN  ; pins 400 499 500 599
V2 V_HIGH_1 GND_SEPIC_1 AC 1V
XC19 N004 GNDH_1 C0805X102K1RACAUTO  ; pins A B
XC20 N004 N006 C0805X104J5RAC3316  ; pins A B
XC21 N004 GNDH_1 C0805X102K1RACAUTO  ; pins A B
XC22 GNDH_1 N006 C0805X102K1RACAUTO  ; pins A B
XC23 GNDH_1 N006 C0805X102K1RACAUTO  ; pins A B
XC24 N004 N006 C0805X102K1RACAUTO  ; pins A B
C25 N004 N006 10µF V=50 Rser=2.2m Lser=0.6n Rpar=0.05G
L3 V_HIGH_1 N004 4.7µH Rser=0.023 Rpar=6.2 Cpar=2.12pF
R2 V_HIGH_1 N005 20m tol=1 pwr=125m
C26 N005 GND_SEPIC_1 330µF V=50 Irms=600m Rser=230m
C27 N004 N006 10µF V=50 Rser=2.2m Lser=0.6n Rpar=0.05G
C28 N004 N006 10µF V=50 Rser=2.2m Lser=0.6n Rpar=0.05G
C29 N004 N006 10µF V=50 Rser=2.2m Lser=0.6n Rpar=0.05G
C30 N004 N006 10µF V=50 Rser=2.2m Lser=0.6n Rpar=0.05G
C31 N004 N006 10µF V=50 Rser=2.2m Lser=0.6n Rpar=0.05G
C32 N004 N006 10µF V=50 Rser=2.2m Lser=0.6n Rpar=0.05G
C33 N004 N006 10µF V=50 Rser=2.2m Lser=0.6n Rpar=0.05G
L4 GND_SEPIC_1 N006 4.7µH Rser=0.023 Rpar=6.2 Cpar=2.12pF
C34 V_HIGH_1 GND_SEPIC_1 10µF V=50 Rser=2.2m Lser=0.6n Rpar=0.05G
C35 V_HIGH_1 GND_SEPIC_1 10µF V=50 Rser=2.2m Lser=0.6n Rpar=0.05G
XC36 V_HIGH_1 GND_SEPIC_1 C0805X104J5RAC3316  ; pins A B
R3 +24V_1 0 50
V3 +24V_2 0 AC 1V
XC37 +24V_2 GNDH_2 C0805X102K1RACAUTO  ; pins A B
XC38 +24V_2 0 C0805X104J5RAC3316  ; pins A B
XC39 +24V_2 GNDH_2 C0805X102K1RACAUTO  ; pins A B
XC40 GNDH_2 0 C0805X102K1RACAUTO  ; pins A B
XC41 GNDH_2 0 C0805X102K1RACAUTO  ; pins A B
XC42 +24V_2 0 C0805X102K1RACAUTO  ; pins A B
C43 +24V_2 0 10µF V=50 Rser=2.2m Lser=0.6n Rpar=0.05G
L5 V_HIGH_2 +24V_2 4.7µH Rser=0.023 Rpar=6.2 Cpar=2.12pF
R4 V_HIGH_2 N007 0.05 tol=1 pwr=125m
C44 N007 GND_SEPIC_2 330µF V=50 Irms=600m Rser=230m
C45 +24V_2 0 10µF V=50 Rser=2.2m Lser=0.6n Rpar=0.05G
C46 +24V_2 0 10µF V=50 Rser=2.2m Lser=0.6n Rpar=0.05G
C47 +24V_2 0 10µF V=50 Rser=2.2m Lser=0.6n Rpar=0.05G
C48 +24V_2 0 10µF V=50 Rser=2.2m Lser=0.6n Rpar=0.05G
C49 +24V_2 0 10µF V=50 Rser=2.2m Lser=0.6n Rpar=0.05G
C50 +24V_2 0 10µF V=50 Rser=2.2m Lser=0.6n Rpar=0.05G
C51 +24V_2 0 10µF V=50 Rser=2.2m Lser=0.6n Rpar=0.05G
L6 GND_SEPIC_2 0 4.7µH Rser=0.023 Rpar=6.2 Cpar=2.12pF
C52 V_HIGH_2 GND_SEPIC_2 10µF V=50 Rser=2.2m Lser=0.6n Rpar=0.05G
C53 V_HIGH_2 GND_SEPIC_2 10µF V=50 Rser=2.2m Lser=0.6n Rpar=0.05G
XC54 V_HIGH_2 GND_SEPIC_2 C0805X104J5RAC3316  ; pins A B
V4 +24V_3 0 AC 1V
XC55 +24V_3 GNDH_3 C0805X102K1RACAUTO  ; pins A B
XC56 +24V_3 0 C0805X104J5RAC3316  ; pins A B
XC57 +24V_3 GNDH_3 C0805X102K1RACAUTO  ; pins A B
XC58 GNDH_3 0 C0805X102K1RACAUTO  ; pins A B
XC59 GNDH_3 0 C0805X102K1RACAUTO  ; pins A B
XC60 +24V_3 0 C0805X102K1RACAUTO  ; pins A B
C61 +24V_3 0 10µF V=50 Rser=2.2m Lser=0.6n Rpar=0.05G
L7 V_HIGH_3 +24V_3 4.7µH Rser=0.023 Rpar=6.2 Cpar=2.12pF
C62 +24V_3 0 10µF V=50 Rser=2.2m Lser=0.6n Rpar=0.05G
C63 +24V_3 0 10µF V=50 Rser=2.2m Lser=0.6n Rpar=0.05G
C64 +24V_3 0 10µF V=50 Rser=2.2m Lser=0.6n Rpar=0.05G
C65 +24V_3 0 10µF V=50 Rser=2.2m Lser=0.6n Rpar=0.05G
C66 +24V_3 0 10µF V=50 Rser=2.2m Lser=0.6n Rpar=0.05G
C67 +24V_3 0 10µF V=50 Rser=2.2m Lser=0.6n Rpar=0.05G
C68 +24V_3 0 10µF V=50 Rser=2.2m Lser=0.6n Rpar=0.05G
L8 GND_SEPIC_3 0 4.7µH Rser=0.023 Rpar=6.2 Cpar=2.12pF
C69 V_HIGH_3 GND_SEPIC_3 10µF V=50 Rser=2.2m Lser=0.6n Rpar=0.05G
C70 V_HIGH_3 GND_SEPIC_3 10µF V=50 Rser=2.2m Lser=0.6n Rpar=0.05G
XC71 V_HIGH_3 GND_SEPIC_3 C0805X104J5RAC3316  ; pins A B
XU3 0 N009 +24V_4 N008 PLT10HH9016R0PN  ; pins 400 499 500 599
V5 V_HIGH_4 GND_SEPIC_4 AC 1V
XC72 N008 GNDH_4 C0805X102K1RACAUTO  ; pins A B
XC73 N008 N009 C0805X104J5RAC3316  ; pins A B
XC74 N008 GNDH_4 C0805X102K1RACAUTO  ; pins A B
XC75 GNDH_4 N009 C0805X102K1RACAUTO  ; pins A B
XC76 GNDH_4 N009 C0805X102K1RACAUTO  ; pins A B
XC77 N008 N009 C0805X102K1RACAUTO  ; pins A B
C78 N008 N009 10µF V=50 Rser=2.2m Lser=0.6n Rpar=0.05G
L9 V_HIGH_4 N008 4.7µH Rser=0.023 Rpar=6.2 Cpar=2.12pF
C80 N008 N009 10µF V=50 Rser=2.2m Lser=0.6n Rpar=0.05G
C81 N008 N009 10µF V=50 Rser=2.2m Lser=0.6n Rpar=0.05G
C82 N008 N009 10µF V=50 Rser=2.2m Lser=0.6n Rpar=0.05G
C83 N008 N009 10µF V=50 Rser=2.2m Lser=0.6n Rpar=0.05G
C84 N008 N009 10µF V=50 Rser=2.2m Lser=0.6n Rpar=0.05G
C85 N008 N009 10µF V=50 Rser=2.2m Lser=0.6n Rpar=0.05G
C86 N008 N009 10µF V=50 Rser=2.2m Lser=0.6n Rpar=0.05G
L10 GND_SEPIC_4 N009 4.7µH Rser=0.023 Rpar=6.2 Cpar=2.12pF
C87 V_HIGH_4 GND_SEPIC_4 10µF V=50 Rser=2.2m Lser=0.6n Rpar=0.05G
C88 V_HIGH_4 GND_SEPIC_4 10µF V=50 Rser=2.2m Lser=0.6n Rpar=0.05G
XC89 V_HIGH_4 GND_SEPIC_4 C0805X104J5RAC3316  ; pins A B
R6 +24V_4 0 50
XU4 0 N011 +24V_5 N010 PLT10HH9016R0PN  ; pins 400 499 500 599
V6 +24V_5 0 AC 1V
XC79 N010 GNDH_5 C0805X102K1RACAUTO  ; pins A B
XC90 N010 N011 C0805X104J5RAC3316  ; pins A B
XC91 N010 GNDH_5 C0805X102K1RACAUTO  ; pins A B
XC92 GNDH_5 N011 C0805X102K1RACAUTO  ; pins A B
XC93 GNDH_5 N011 C0805X102K1RACAUTO  ; pins A B
XC94 N010 N011 C0805X102K1RACAUTO  ; pins A B
C95 N010 N011 10µF V=50 Rser=2.2m Lser=0.6n Rpar=0.05G
L11 V_HIGH_5 N010 4.7µH Rser=0.023 Rpar=6.2 Cpar=2.12pF
C97 N010 N011 10µF V=50 Rser=2.2m Lser=0.6n Rpar=0.05G
C98 N010 N011 10µF V=50 Rser=2.2m Lser=0.6n Rpar=0.05G
C99 N010 N011 10µF V=50 Rser=2.2m Lser=0.6n Rpar=0.05G
C100 N010 N011 10µF V=50 Rser=2.2m Lser=0.6n Rpar=0.05G
C101 N010 N011 10µF V=50 Rser=2.2m Lser=0.6n Rpar=0.05G
C102 N010 N011 10µF V=50 Rser=2.2m Lser=0.6n Rpar=0.05G
C103 N010 N011 10µF V=50 Rser=2.2m Lser=0.6n Rpar=0.05G
L12 GND_SEPIC_5 N011 4.7µH Rser=0.023 Rpar=6.2 Cpar=2.12pF
C104 V_HIGH_5 GND_SEPIC_5 10µF V=50 Rser=2.2m Lser=0.6n Rpar=0.05G
C105 V_HIGH_5 GND_SEPIC_5 10µF V=50 Rser=2.2m Lser=0.6n Rpar=0.05G
XC106 V_HIGH_5 GND_SEPIC_5 C0805X104J5RAC3316  ; pins A B
.ac dec 10 10 1G
.inc C:\Users\KMI3BP\Documents\LTspice\C0805X104J5RAC3316_SPICE.CKT
.inc C:\Users\KMI3BP\Documents\LTspice\C0805X102K1RACAUTO_SPICE.CKT
* .tran 0 10 0 1
.lib C:\Users\KMI3BP\Downloads\PLT10HH9016R0PN.mod
.backanno
.end